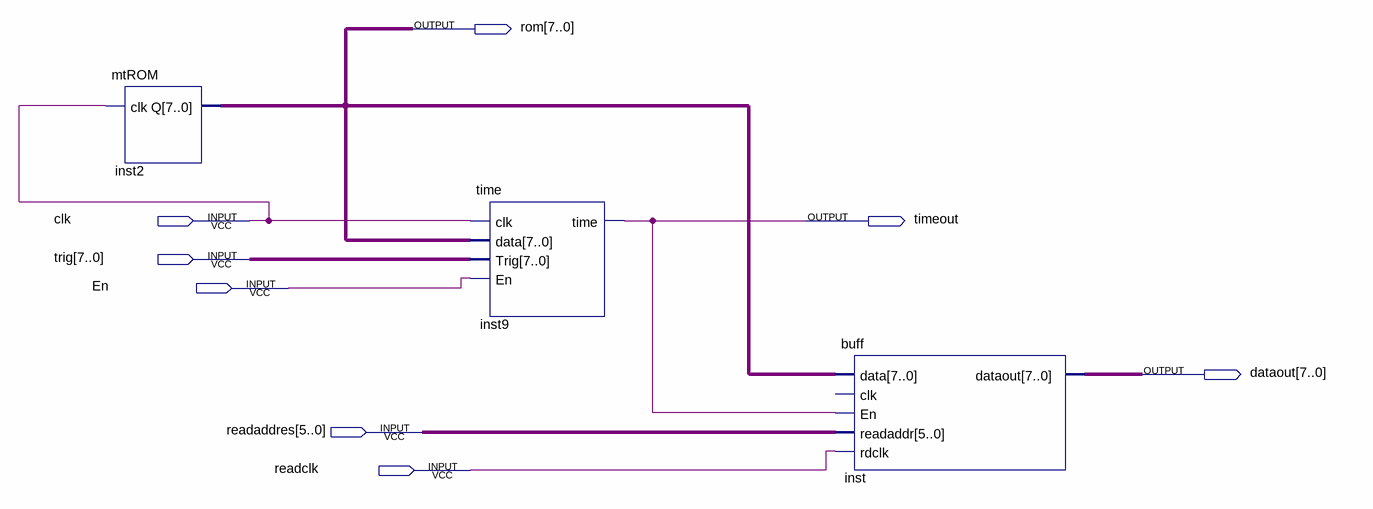
[diagram p0: schematic sheet]
// Quartus schematic RAM.bdf as structural Verilog: 3 symbols, 8 pins
module RAM (
  input  clk,
  input  [7:0] trig,
  input  En,
  input  [5:0] readaddres,
  input  readclk,
  output [7:0] rom,
  output timeout,
  output [7:0] dataout
);

  mtROM inst2 (.clk(clk), .Q(rom));
  \time  inst9 (.clk(clk), .data(rom), .Trig(trig), .En(En), .\time (timeout));
  buff inst (.data(rom), .En(timeout), .readaddr(readaddres), .rdclk(readclk), .dataout(dataout));  // open: clk
endmodule
